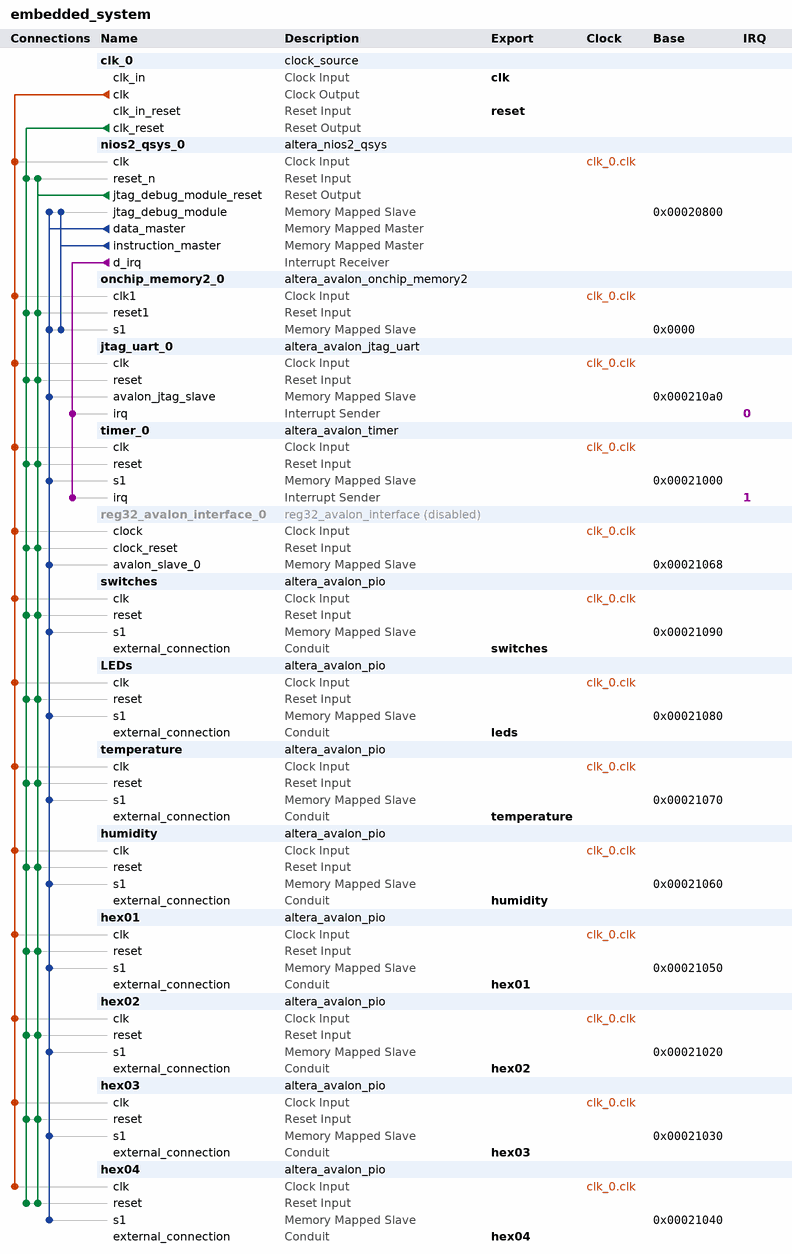
[diagram p0: system contents]
# Platform Designer (Qsys) system embedded_system, Cyclone V 5CSEMA5F31C6
# Parameters at their usual value, and those the tool derives, are not listed.
package require -exact qsys 18.1
create_system embedded_system
set_project_property DEVICE_FAMILY {Cyclone V}
set_project_property DEVICE 5CSEMA5F31C6

add_instance clk_0 clock_source 18.1
set_instance_parameter_value clk_0 clockFrequency 50000000

add_instance nios2_qsys_0 altera_nios2_qsys 16.1
set_instance_parameter_value nios2_qsys_0 breakSlave nios2_qsys_0.jtag_debug_module
set_instance_parameter_value nios2_qsys_0 exceptionSlave onchip_memory2_0.s1
set_instance_parameter_value nios2_qsys_0 icache_size 4096
set_instance_parameter_value nios2_qsys_0 impl Tiny
set_instance_parameter_value nios2_qsys_0 mmu_TLBMissExcSlave None
set_instance_parameter_value nios2_qsys_0 resetSlave onchip_memory2_0.s1
set_instance_parameter_value nios2_qsys_0 resetrequest_enabled true

add_instance onchip_memory2_0 altera_avalon_onchip_memory2 18.1
set_instance_parameter_value onchip_memory2_0 dataWidth 32
set_instance_parameter_value onchip_memory2_0 dualPort false
set_instance_parameter_value onchip_memory2_0 initMemContent true
set_instance_parameter_value onchip_memory2_0 initializationFileName onchip_mem.hex
set_instance_parameter_value onchip_memory2_0 memorySize 131072

add_instance jtag_uart_0 altera_avalon_jtag_uart 18.1
set_instance_parameter_value jtag_uart_0 simInteractiveOptions NO_INTERACTIVE_WINDOWS

add_instance timer_0 altera_avalon_timer 18.1
set_instance_parameter_value timer_0 period 1
set_instance_parameter_value timer_0 periodUnits MSEC

add_instance reg32_avalon_interface_0 reg32_avalon_interface 1.0
set_instance_property reg32_avalon_interface_0 ENABLED false

add_instance switches altera_avalon_pio 18.1
set_instance_parameter_value switches direction Input
set_instance_parameter_value switches width 10

add_instance LEDs altera_avalon_pio 18.1
set_instance_parameter_value LEDs direction Output
set_instance_parameter_value LEDs width 10

add_instance temperature altera_avalon_pio 18.1
set_instance_parameter_value temperature direction Input
set_instance_parameter_value temperature width 12

add_instance humidity altera_avalon_pio 18.1
set_instance_parameter_value humidity direction Input
set_instance_parameter_value humidity width 12

add_instance hex01 altera_avalon_pio 18.1
set_instance_parameter_value hex01 direction Output
set_instance_parameter_value hex01 width 7

add_instance hex02 altera_avalon_pio 18.1
set_instance_parameter_value hex02 direction Output
set_instance_parameter_value hex02 width 7

add_instance hex03 altera_avalon_pio 18.1
set_instance_parameter_value hex03 direction Output
set_instance_parameter_value hex03 width 7

add_instance hex04 altera_avalon_pio 18.1
set_instance_parameter_value hex04 direction Output
set_instance_parameter_value hex04 width 7

# connections
add_connection clk_0.clk hex01.clk clock
add_connection clk_0.clk hex02.clk clock
add_connection clk_0.clk hex03.clk clock
add_connection clk_0.clk hex04.clk clock
add_connection clk_0.clk humidity.clk clock
add_connection clk_0.clk jtag_uart_0.clk clock
add_connection clk_0.clk LEDs.clk clock
add_connection clk_0.clk nios2_qsys_0.clk clock
add_connection clk_0.clk onchip_memory2_0.clk1 clock
add_connection clk_0.clk reg32_avalon_interface_0.clock clock
add_connection clk_0.clk switches.clk clock
add_connection clk_0.clk temperature.clk clock
add_connection clk_0.clk timer_0.clk clock
add_connection clk_0.clk_reset hex01.reset reset
add_connection clk_0.clk_reset hex02.reset reset
add_connection clk_0.clk_reset hex03.reset reset
add_connection clk_0.clk_reset hex04.reset reset
add_connection clk_0.clk_reset humidity.reset reset
add_connection clk_0.clk_reset jtag_uart_0.reset reset
add_connection clk_0.clk_reset LEDs.reset reset
add_connection clk_0.clk_reset nios2_qsys_0.reset_n reset
add_connection clk_0.clk_reset onchip_memory2_0.reset1 reset
add_connection clk_0.clk_reset reg32_avalon_interface_0.clock_reset reset
add_connection clk_0.clk_reset switches.reset reset
add_connection clk_0.clk_reset temperature.reset reset
add_connection clk_0.clk_reset timer_0.reset reset
add_connection nios2_qsys_0.jtag_debug_module_reset hex01.reset reset
add_connection nios2_qsys_0.jtag_debug_module_reset hex02.reset reset
add_connection nios2_qsys_0.jtag_debug_module_reset hex03.reset reset
add_connection nios2_qsys_0.jtag_debug_module_reset hex04.reset reset
add_connection nios2_qsys_0.jtag_debug_module_reset humidity.reset reset
add_connection nios2_qsys_0.jtag_debug_module_reset jtag_uart_0.reset reset
add_connection nios2_qsys_0.jtag_debug_module_reset LEDs.reset reset
add_connection nios2_qsys_0.jtag_debug_module_reset nios2_qsys_0.reset_n reset
add_connection nios2_qsys_0.jtag_debug_module_reset onchip_memory2_0.reset1 reset
add_connection nios2_qsys_0.jtag_debug_module_reset reg32_avalon_interface_0.clock_reset reset
add_connection nios2_qsys_0.jtag_debug_module_reset switches.reset reset
add_connection nios2_qsys_0.jtag_debug_module_reset temperature.reset reset
add_connection nios2_qsys_0.jtag_debug_module_reset timer_0.reset reset
add_connection nios2_qsys_0.data_master hex01.s1 avalon
set_connection_parameter_value nios2_qsys_0.data_master/hex01.s1 baseAddress 0x00021050
add_connection nios2_qsys_0.data_master hex02.s1 avalon
set_connection_parameter_value nios2_qsys_0.data_master/hex02.s1 baseAddress 0x00021020
add_connection nios2_qsys_0.data_master hex03.s1 avalon
set_connection_parameter_value nios2_qsys_0.data_master/hex03.s1 baseAddress 0x00021030
add_connection nios2_qsys_0.data_master hex04.s1 avalon
set_connection_parameter_value nios2_qsys_0.data_master/hex04.s1 baseAddress 0x00021040
add_connection nios2_qsys_0.data_master humidity.s1 avalon
set_connection_parameter_value nios2_qsys_0.data_master/humidity.s1 baseAddress 0x00021060
add_connection nios2_qsys_0.data_master jtag_uart_0.avalon_jtag_slave avalon
set_connection_parameter_value nios2_qsys_0.data_master/jtag_uart_0.avalon_jtag_slave baseAddress 0x000210a0
add_connection nios2_qsys_0.data_master LEDs.s1 avalon
set_connection_parameter_value nios2_qsys_0.data_master/LEDs.s1 baseAddress 0x00021080
add_connection nios2_qsys_0.data_master nios2_qsys_0.jtag_debug_module avalon
set_connection_parameter_value nios2_qsys_0.data_master/nios2_qsys_0.jtag_debug_module baseAddress 0x00020800
add_connection nios2_qsys_0.data_master onchip_memory2_0.s1 avalon
set_connection_parameter_value nios2_qsys_0.data_master/onchip_memory2_0.s1 baseAddress 0x0000
add_connection nios2_qsys_0.data_master reg32_avalon_interface_0.avalon_slave_0 avalon
set_connection_parameter_value nios2_qsys_0.data_master/reg32_avalon_interface_0.avalon_slave_0 baseAddress 0x00021068
add_connection nios2_qsys_0.data_master switches.s1 avalon
set_connection_parameter_value nios2_qsys_0.data_master/switches.s1 baseAddress 0x00021090
add_connection nios2_qsys_0.data_master temperature.s1 avalon
set_connection_parameter_value nios2_qsys_0.data_master/temperature.s1 baseAddress 0x00021070
add_connection nios2_qsys_0.data_master timer_0.s1 avalon
set_connection_parameter_value nios2_qsys_0.data_master/timer_0.s1 baseAddress 0x00021000
add_connection nios2_qsys_0.instruction_master nios2_qsys_0.jtag_debug_module avalon
set_connection_parameter_value nios2_qsys_0.instruction_master/nios2_qsys_0.jtag_debug_module baseAddress 0x00020800
add_connection nios2_qsys_0.instruction_master onchip_memory2_0.s1 avalon
set_connection_parameter_value nios2_qsys_0.instruction_master/onchip_memory2_0.s1 baseAddress 0x0000
add_connection nios2_qsys_0.d_irq jtag_uart_0.irq interrupt
set_connection_parameter_value nios2_qsys_0.d_irq/jtag_uart_0.irq irqNumber 0
add_connection nios2_qsys_0.d_irq timer_0.irq interrupt
set_connection_parameter_value nios2_qsys_0.d_irq/timer_0.irq irqNumber 1

# exported interfaces
add_interface clk clock sink
set_interface_property clk EXPORT_OF clk_0.clk_in
add_interface hex01 conduit end
set_interface_property hex01 EXPORT_OF hex01.external_connection
add_interface hex02 conduit end
set_interface_property hex02 EXPORT_OF hex02.external_connection
add_interface hex03 conduit end
set_interface_property hex03 EXPORT_OF hex03.external_connection
add_interface hex04 conduit end
set_interface_property hex04 EXPORT_OF hex04.external_connection
add_interface humidity conduit end
set_interface_property humidity EXPORT_OF humidity.external_connection
add_interface leds conduit end
set_interface_property leds EXPORT_OF LEDs.external_connection
add_interface reset reset sink
set_interface_property reset EXPORT_OF clk_0.clk_in_reset
add_interface switches conduit end
set_interface_property switches EXPORT_OF switches.external_connection
add_interface temperature conduit end
set_interface_property temperature EXPORT_OF temperature.external_connection

set_interconnect_requirement {$system} qsys_mm.clockCrossingAdapter HANDSHAKE
set_interconnect_requirement {$system} qsys_mm.enableEccProtection FALSE
set_interconnect_requirement {$system} qsys_mm.insertDefaultSlave FALSE
set_interconnect_requirement {$system} qsys_mm.maxAdditionalLatency 1

save_system embedded_system.qsys
